# Altium schematic sheet SNI_PROTO_sch.SchDoc
size A4
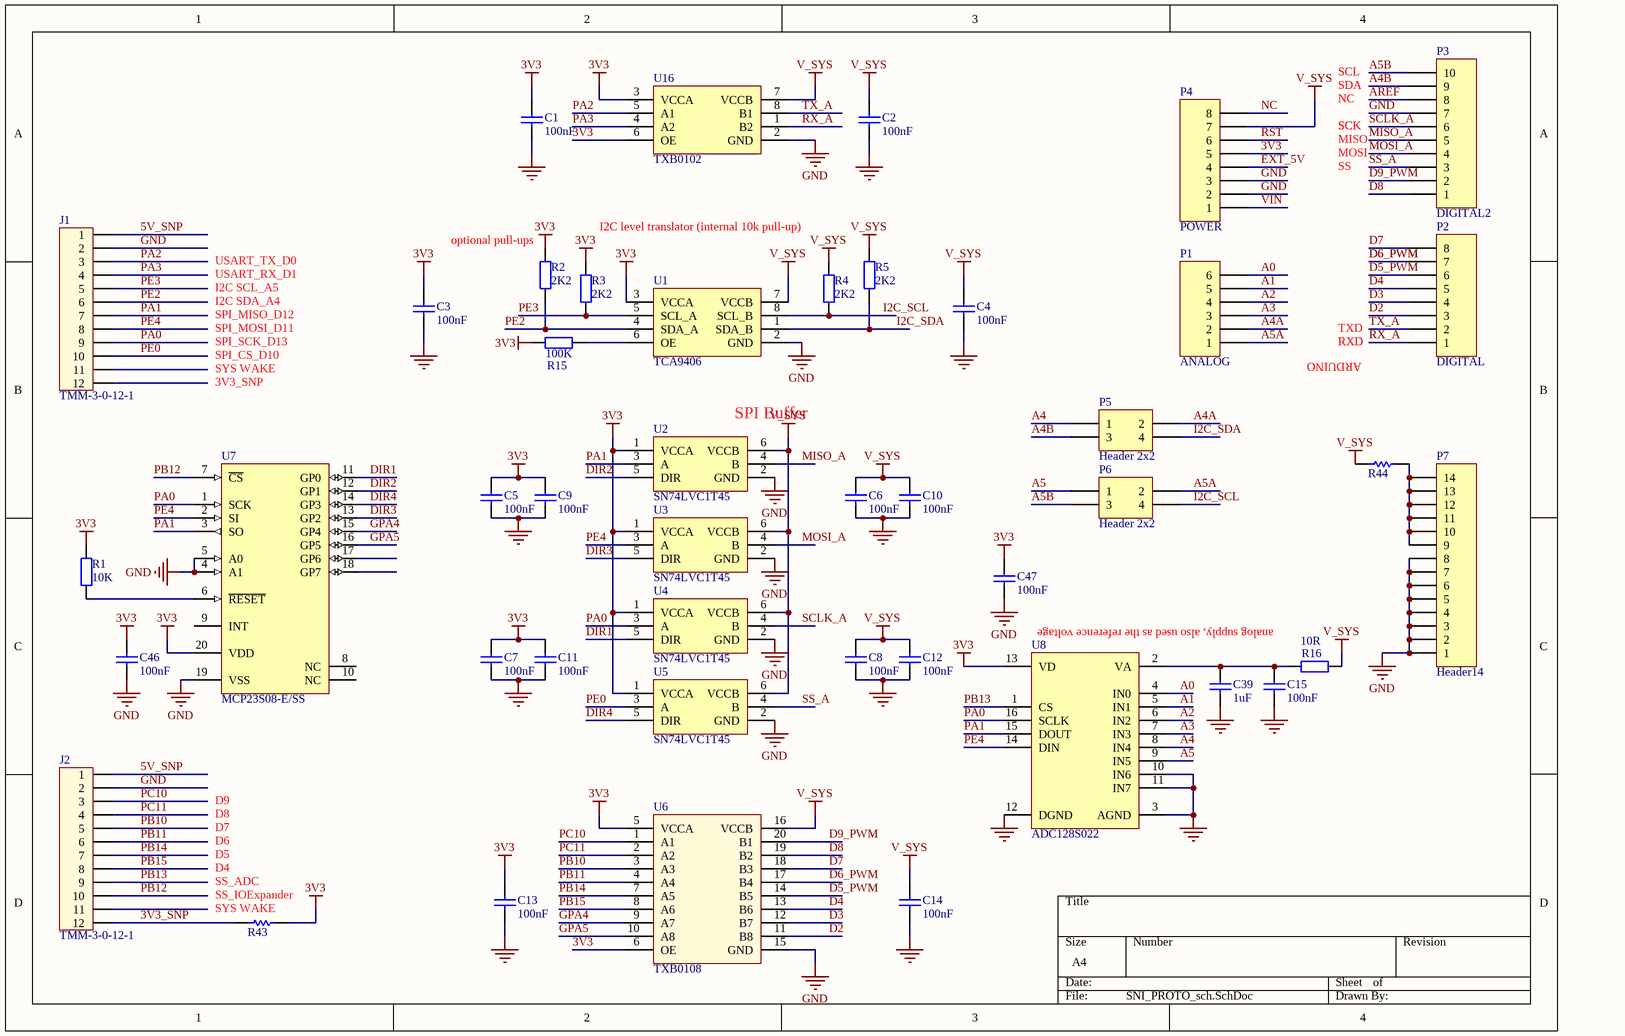
[diagram p0: SNI_PROTO_sch.SchDoc]

## Parts
C1  value 100nF  [CAPC0402(1005)60_L]  (hidden comment: CAP 100nF 10V 0402(1005))
C2  value 100nF  [CAPC0402(1005)60_L]  (hidden comment: CAP 100nF 10V 0402(1005))
C3  value 100nF  [CAPC0402(1005)60_L]  (hidden comment: CAP 100nF 10V 0402(1005))
C4  value 100nF  [CAPC0402(1005)60_L]  (hidden comment: CAP 100nF 10V 0402(1005))
C5  value 100nF  [CAPC0402(1005)60_L]  (hidden comment: CAP 100nF 10V 0402(1005))
C6  value 100nF  [CAPC0402(1005)60_L]  (hidden comment: CAP 100nF 10V 0402(1005))
C7  value 100nF  [CAPC0402(1005)60_L]  (hidden comment: CAP 100nF 10V 0402(1005))
C8  value 100nF  [CAPC0402(1005)60_L]  (hidden comment: CAP 100nF 10V 0402(1005))
C9  value 100nF  [CAPC0402(1005)60_L]  (hidden comment: CAP 100nF 10V 0402(1005))
C10  value 100nF  [CAPC0402(1005)60_L]  (hidden comment: CAP 100nF 10V 0402(1005))
C11  value 100nF  [CAPC0402(1005)60_L]  (hidden comment: CAP 100nF 10V 0402(1005))
C12  value 100nF  [CAPC0402(1005)60_L]  (hidden comment: CAP 100nF 10V 0402(1005))
C13  value 100nF  [CAPC0402(1005)60_L]  (hidden comment: CAP 100nF 10V 0402(1005))
C14  value 100nF  [CAPC0402(1005)60_L]  (hidden comment: CAP 100nF 10V 0402(1005))
C15  value 100nF  [CAPC0402(1005)60_L]  (hidden comment: CAP 100nF 10V 0402(1005))
C39  value 1uF  [CAPC0402(1005)60_L]  (hidden comment: CAP 1uF 10V 0402(1005))
C46  value 100nF  [CAPC0402(1005)60_L]  (hidden comment: CAP 100nF 10V 0402(1005))
C47  value 100nF  [CAPC0402(1005)60_L]  (hidden comment: CAP 100nF 10V 0402(1005))
J1  TMM-3-0-12-1  [TMM-3-0-12-1]
J2  TMM-3-0-12-1  [TMM-3-0-12-1]
P1  ANALOG  [H6A]
P2  DIGITAL  [H8A]
P3  DIGITAL2  [H10A]
P4  POWER  [H8A]
P5  Header 2x2  [H2x2]
P6  Header 2x2  [H2x2]
P7  Header14  [H14]
R1  value 10K  [RESC0402(1005)_L]  (hidden comment: 10K 1% 0402(1005))
R2  value 2K2  [RESC0402(1005)_L]  (hidden comment: 2K2 1% 0402(1005))
R3  value 2K2  [RESC0402(1005)_L]  (hidden comment: 2K2 1% 0402(1005))
R4  value 2K2  [RESC0402(1005)_L]  (hidden comment: 2K2 1% 0402(1005))
R5  value 2K2  [RESC0402(1005)_L]  (hidden comment: 2K2 1% 0402(1005))
R15  value 100K  [RESC0402(1005)_L]  (hidden comment: 100K 1% 0402(1005))
R16  value 10R  [RESC0603(1608)_N]  (hidden comment: 10R 1% 0603(1608))
R43  Jumper 0805(2012)  [RESC0805(2012)_N]  (value not drawn)
R44  1R 5% 1210(3225)  [RESC1210(3225)_N]  (value not drawn)
U1  TCA9406  [LSSOP-8]
U2  SN74LVC1T45  [SOT6_DRL]
U3  SN74LVC1T45  [SOT6_DRL]
U4  SN74LVC1T45  [SOT6_DRL]
U5  SN74LVC1T45  [SOT6_DRL]
U6  TXB0108  [UFDFN-20]
U7  MCP23S08-E/SS  [SSOP-SS20_N]
U8  ADC128S022  [TSSOP16]
U16  TXB0102  [VSSOP8]

## Nets
3V3: C1.1 C3.1 C5.1 C7.1 C9.2 C11.2 C13.2 C46.1 C47.1 P4.5 R1.2 R2.2 R3.2 R15.1 R43.2 U1.3(VCCA) U2.1(VCCA) U3.1(VCCA) U4.1(VCCA) U5.1(VCCA) U6.5(VCCA) U6.6(OE) U7.20(VDD) U8.13(VD) U16.3(VCCA) U16.6(OE)
GND: C1.2 C2.2 C3.2 C4.2 C5.2 C6.2 C7.2 C8.2 C9.1 C10.1 C11.1 C12.1 C13.1 C14.1 C15.1 C39.1 C46.2 C47.2 J1.2 J2.2 P3.7 P4.2 P4.3 P7.1 P7.2 P7.3 P7.4 P7.5 P7.6 P7.7 P7.8 U1.2(GND) U2.2(GND) U3.2(GND) U4.2(GND) U5.2(GND) U6.15(GND) U7.4(A1) U7.5(A0) U7.19(VSS) U8.3(AGND) U8.10(IN6) U8.11(IN7) U8.12(DGND) U16.2(GND)
V_SYS: C2.1 C4.1 C6.1 C8.1 C10.2 C12.2 C14.2 P4.7 R4.2 R5.2 R16.2 R44.1 U1.7(VCCB) U2.6(VCCB) U3.6(VCCB) U4.6(VCCB) U5.6(VCCB) U6.16(VCCB) U16.7(VCCB)
3V3_SNP: J2.12 R43.1
5V_SNP: J1.1 J2.1
A0: P1.6 U8.4(IN0)
A1: P1.5 U8.5(IN1)
A2: P1.4 U8.6(IN2)
A3: P1.3 U8.7(IN3)
A4: P5.1 U8.8(IN4)
A4A: P1.2 P5.2
A4B: P3.9 P5.3
A5: P6.1 U8.9(IN5)
A5A: P1.1 P6.2
A5B: P3.10 P6.3
AREF: P3.8
D2: P2.3 U6.11(B8)
D3: P2.4 U6.12(B7)
D4: P2.5 U6.13(B6)
D5_PWM: P2.6 U6.14(B5)
D6_PWM: P2.7 U6.17(B4)
D7: P2.8 U6.18(B3)
D8: P3.1 U6.19(B2)
D9_PWM: P3.2 U6.20(B1)
DIR1: U4.5(DIR) U7.11(GP0)
DIR2: U2.5(DIR) U7.12(GP1)
DIR3: U3.5(DIR) U7.13(GP2)
DIR4: U5.5(DIR) U7.14(GP3)
EXT_5V: P4.4
GPA4: U6.9(A7) U7.15(GP4)
GPA5: U6.10(A8) U7.16(GP5)
I2C_SCL: P6.4 R4.1 U1.8(SCL_B)
I2C_SDA: P5.4 R5.1 U1.1(SDA_B)
MISO_A: P3.5 U2.4(B)
MOSI_A: P3.4 U3.4(B)
NC: P4.8
PA0: J1.9 U4.3(A) U7.1(SCK) U8.16(SCLK)
PA1: J1.7 U2.3(A) U7.3(SO) U8.15(DOUT)
PA2: J1.3 U16.5(A1)
PA3: J1.4 U16.4(A2)
PB10: J2.5 U6.3(A3)
PB11: J2.6 U6.4(A4)
PB12: J2.10 U7.7(~{CS})
PB13: J2.9 U8.1(CS)
PB14: J2.7 U6.7(A5)
PB15: J2.8 U6.8(A6)
PC10: J2.3 U6.1(A1)
PC11: J2.4 U6.2(A2)
PE0: J1.10 U5.3(A)
PE2: J1.6 R2.1 U1.4(SDA_A)
PE3: J1.5 R3.1 U1.5(SCL_A)
PE4: J1.8 U3.3(A) U7.2(SI) U8.14(DIN)
RST: P4.6
RX_A: P2.1 U16.1(B2)
SCLK_A: P3.6 U4.4(B)
SS_A: P3.3 U5.4(B)
TX_A: P2.2 U16.8(B1)
VIN: P4.1
NetC15_2: C15.2 C39.2 R16.1 U8.2(VA)
NetP7_9: P7.9 P7.10 P7.11 P7.12 P7.13 P7.14 R44.2
NetR1_1: R1.1 U7.6(~{RESET})
NetR15_2: R15.2 U1.6(OE)

Not connected (* = marked no-connect by the designer): J1 11 12; J2 11; U7 8(NC) 9(INT) 10(NC) 17(GP6) 18(GP7)

## Notes on the sheet
- SCL
- SDA
- NC
- MISO
- SCK
- MOSI
- SS
- (near R2) optional pull-ups
- I2C level translator (internal 10k pull-up)
- USART_RX_D1
- USART_TX_D0
- I2C SCL_A5
- I2C SDA_A4
- SPI_SCK_D13
- SPI_MOSI_D11
- SPI_MISO_D12
- SPI_CS_D10
- SYS WAKE
- 3V3_SNP
- RXD
- TXD
- ARDUINO
- (near U2) SPI Buffer
- analog supply, also used as the reference voltage
- D6
- D7
- D8
- D9
- (near R43) SS_ADC
- (near R43) SS_IOExpander
- D5
- (near R43) D4
- (near R43) SYS WAKE

## Library data of the parts
C1-C15 C46 C47 = CMP-1034-02064-1: CAP 100nF 10V ±5% 0402 (1005 Metric) Thickness 0.6mm SMD; Tolerance: Â±5%; Case-EIA: 0402; Case-Metric: 1005; Max Thickness: 0.6 mm; Rated Voltage: 10 V; Technology: SMT
C39 = CMP-1034-02117-1: CAP 1uF 10V ±20% 0402 (1005 Metric) Thickness 0.6mm SMD; Case-Metric: 1005; Tolerance: Â±20%; Case-EIA: 0402; Max Thickness: 0.6 mm; Rated Voltage: 10 V; Technology: SMT
J1 J2 = TMM-3-0-12-1: PLUG, DIP, 1.27MM, 12WAY; Manufacturer: AMPHENOL; Supplier 1: Farnell; Supplier Part Number 1: 1865058; Manufacturer Part Number: TMM-3-0-12-1; Supplier 2: Digikey; Supplier 3: Mouser; Supplier Part Number 2: N/A; Supplier Part Number 3: N/A
P1 = header6A
P2 P4 = Header8A
P3 = Header10A
P5 P6 = Header
R1 = 10K 0402(1005)_1: 10K 0.063W 1% 0402 (1005 Metric)  SMD; Case-EIA: 0402; Case-Metric: 1005; Power: 0.063W; Technology: SMT; Tolerance: 1%
R2-R5 = 2K2 0402(1005): 2K2 0.063W 1% 0402 (1005 Metric)  SMD; Case-EIA: 0402; Case-Metric: 1005; Power: 0.063W; Technology: SMT; Tolerance: 1%
R15 = 100K 0402(1005): 100K 0.063W 1% 0402 (1005 Metric)  SMD; Case-EIA: 0402; Case-Metric: 1005; Power: 0.063W; Technology: SMT; Tolerance: 1%
R16 = 10R 0603(1608): 10R 0.1W 1% 0603 (1608 Metric)  SMD; Case-EIA: 0603; Case-Metric: 1608; Power: 0.1W; Technology: SMT; Tolerance: 1%
R43 = CMP-1013-00001-1: Jumper 0805 (2012 Metric); Case-EIA: 0805; Value: 0.00 Ohm; Tolerance: None; Case-Metric: 2012; Technology: SMT; Power: None
R44 = CMP-1015-00002-1: 1R 0.5W 5% 1210 (3225 Metric)  SMD; Case-EIA: 1210; Value: 1.00 Ohm; Case-Metric: 3225; Power: 0.5 W; Technology: SMT; Tolerance: 5 %
U6 = TXB0108: Translator, Bidirectional, 8 bits data rate 100Mbps; Manufacturer Part Number: TXB0108DQSR; Manufacturer: Texas Instruments; Supplier Part Number 1: 2352272; Supplier Part Number 2: 296-27217-1-ND; Supplier 1: Farnell; Supplier 2: Digikey; ComponentLink1URL: http://www.ti.com/lit/ds/symlink/txb0108.pdf; ComponentLink1Description: Datasheet; Supplier 3: Mouser; Supplier Part Number 3: 595-TXB0108DQSR; Mounting Style: SMD/SMT
U7 = MCP23S08-E/SS: 8-Bit I/O Expander with Serial Interface, 20-Pin SSOP, Extended Temperature; Published: 29-Jan-2009; DatasheetVersion: revE, Aug-2007; PackageVersion: revBB, Aug-2009; PackageReference: SSOP-SS20; Publisher: Altium Limited; PackageDescription: 20-Lead Plastic Shrink Small Outline (SS) - 5.3mm Body [SSOP]; Supplier 1: Digi-Key; Supplier Part Number 1: MCP23S08-E/SS-ND; Supplier 2: Farnell; Supplier Part Number 2: 1292236; Code_JEDEC: MO-150; Code_IPC: SOP65P780-20; ComponentLink1Description: Datasheet; ComponentLink1URL: http://ww1.microchip.com/downloads/en/DeviceDoc/21919e.pdf; ComponentLink2Description: Packaging Specification; ComponentLink2URL: http://www.microchip.com/stellent/groups/techpub_sg/documents/packagingspec/en012702.pdf; ComponentLink3Description: Microchip.com Home; ComponentLink3URL: http://www.microchip.com/
U1 = TCA9406: Supplier 1: Farnell; Supplier 2: Digi-Key; Supplier 3: Mouser; Supplier Part Number 1: 1972384; Supplier Part Number 2: 296-28108-1-ND; Supplier Part Number 3: 595-TCA9406DCTR
U2-U5 = SN74LVC1T45: Supplier 1: Farnell; Supplier 2: Digi_Key; Supplier 3: Mouser; Supplier Part Number 1: N/A; Supplier Part Number 2: 296-20629-1-ND; Supplier Part Number 3: 595-SN74LVC1T45DRLR
U8 = ADC128S022: Supplier 1: Farnell; Supplier 2: Digi-Key; Supplier 3: Mouser; Supplier Part Number 1: 2496156; Supplier Part Number 2: 296-38561-2-ND; Supplier Part Number 3: 926-A128S022CIMTXNPB
U16 = TXB0102: Supplier 1: Farnell; Supplier 2: Digi_Key; Supplier 3: Mouser; Supplier Part Number 1: 2295723; Supplier Part Number 3: 595-TXB0102DCUR; Supplier Part Number 2: 296-22862-1-ND